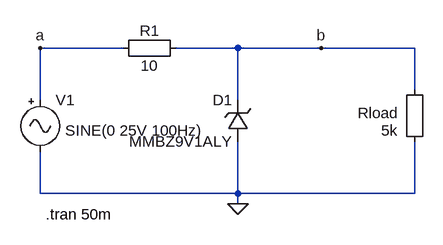
[diagram p0: schematic Zener-Limiter-3.asc]
Zener-Limiter-3.asc, the LTspice schematic file:
Version 4
SHEET 1 880 680
WIRE 32 144 -96 144
WIRE 208 144 112 144
WIRE 336 144 208 144
WIRE 480 144 336 144
WIRE 480 208 480 144
WIRE -96 224 -96 144
WIRE 208 224 208 144
WIRE -96 368 -96 304
WIRE 208 368 208 288
WIRE 208 368 -96 368
WIRE 480 368 480 288
WIRE 480 368 208 368
WIRE 208 384 208 368
FLAG -96 144 a
FLAG 336 144 b
FLAG 208 384 0
SYMBOL Misc\\signal -96 208 R0
WINDOW 123 0 0 Left 2
WINDOW 39 0 0 Left 2
WINDOW 3 38 63 Left 2
SYMATTR Value SINE(0 25V 100Hz)
SYMATTR InstName V1
SYMBOL Misc\\EuropeanResistor 128 128 R90
WINDOW 0 5 56 VBottom 2
WINDOW 3 27 56 VTop 2
SYMATTR InstName R1
SYMATTR Value 10
SYMBOL zener 224 288 R180
WINDOW 3 24 0 Left 2
WINDOW 0 24 64 Left 2
SYMATTR Value MMBZ9V1ALY
SYMATTR InstName D1
SYMATTR Description Diode
SYMATTR Type diode
SYMBOL Misc\\EuropeanResistor 496 304 R180
WINDOW 0 41 60 Left 2
WINDOW 3 42 33 Left 2
SYMATTR InstName Rload
SYMATTR Value 5k
TEXT -88 400 Left 2 !.tran 50m

The netlist it stands for:
* Zener-Limiter-3.asc
V1 a 0 SINE(0 25V 100Hz)
R1 b a 10
D1 0 b MMBZ9V1ALY
Rload 0 b 5k
.model D D
.lib standard.dio
.tran 50m
.backanno
.end